# EAGLE schematic MCPGrundplatte8Eingabe_8Ausgabe (EAGLE 9.6.2)
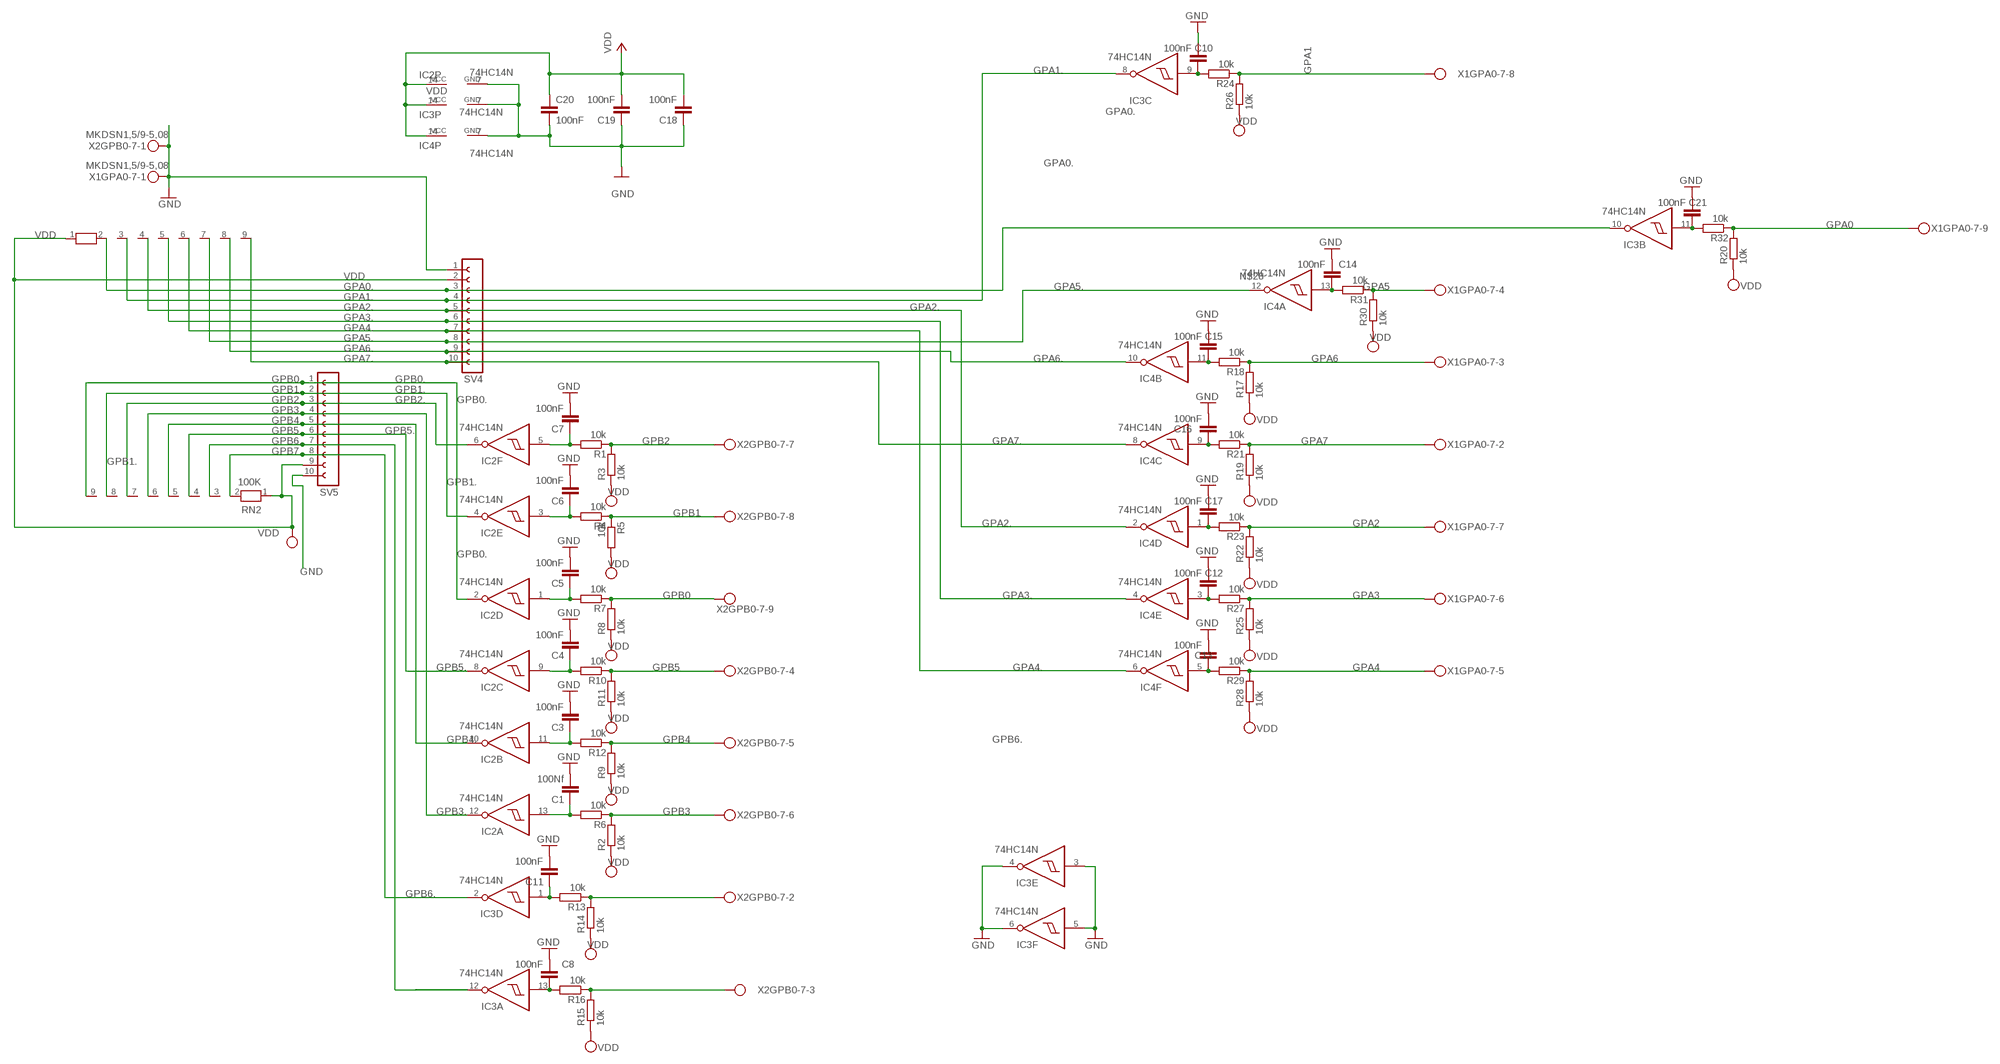
[diagram p0: schematic, sheet 1]

## Parts
C1  100Nf  C-EU025-024X044  [C025-024X044]
C3  100nF  C-EU025-024X044  [C025-024X044]
C4  100nF  C-EU025-024X044  [C025-024X044]
C5  100nF  C-EU025-024X044  [C025-024X044]
C6  100nF  C-EU025-024X044  [C025-024X044]
C7  100nF  C-EU025-024X044  [C025-024X044]
C8  100nF  C-EU025-024X044  [C025-024X044]
C10  100nF  C-EU025-024X044  [C025-024X044]
C11  100nF  C-EU025-024X044  [C025-024X044]
C12  100nF  C-EU025-024X044  [C025-024X044]
C13  100nF  C-EU025-024X044  [C025-024X044]
C14  100nF  C-EU025-024X044  [C025-024X044]
C15  100nF  C-EU025-024X044  [C025-024X044]
C16  100nF  C-EU025-024X044  [C025-024X044]
C17  100nF  C-EU025-024X044  [C025-024X044]
C18  100nF  C-EU025-024X044  [C025-024X044]
C19  100nF  C-EU025-024X044  [C025-024X044]
C20  100nF  C-EU025-024X044  [C025-024X044]
C21  100nF  C-EU025-024X044  [C025-024X044]
IC2  74HC14N  [DIL14]
IC3  74HC14N  [DIL14]
IC4  74HC14N  [DIL14]
R1  10k  R-EU_0207/10  [0207/10]
R2  10k  R-EU_0207/10  [0207/10]
R3  10k  R-EU_0207/10  [0207/10]
R4  10k  R-EU_0207/10  [0207/10]
R5  10k  R-EU_0207/10  [0207/10]
R6  10k  R-EU_0207/10  [0207/10]
R7  10k  R-EU_0207/10  [0207/10]
R8  10k  R-EU_0207/10  [0207/10]
R9  10k  R-EU_0207/10  [0207/10]
R10  10k  R-EU_0207/10  [0207/10]
R11  10k  R-EU_0207/10  [0207/10]
R12  10k  R-EU_0207/10  [0207/10]
R13  10k  R-EU_0207/10  [0207/10]
R14  10k  R-EU_0207/10  [0207/10]
R15  10k  R-EU_0207/10  [0207/10]
R16  10k  R-EU_0207/10  [0207/10]
R17  10k  R-EU_0207/10  [0207/10]
R18  10k  R-EU_0207/10  [0207/10]
R19  10k  R-EU_0207/10  [0207/10]
R20  10k  R-EU_0207/10  [0207/10]
R21  10k  R-EU_0207/10  [0207/10]
R22  10k  R-EU_0207/10  [0207/10]
R23  10k  R-EU_0207/10  [0207/10]
R24  10k  R-EU_0207/10  [0207/10]
R25  10k  R-EU_0207/10  [0207/10]
R26  10k  R-EU_0207/10  [0207/10]
R27  10k  R-EU_0207/10  [0207/10]
R28  10k  R-EU_0207/10  [0207/10]
R29  10k  R-EU_0207/10  [0207/10]
R30  10k  R-EU_0207/10  [0207/10]
R31  10k  R-EU_0207/10  [0207/10]
R32  10k  R-EU_0207/10  [0207/10]
RN1  100K  RN08  [RN-9]
RN2  100K  RN08  [RN-9]
SV4  FE10-1  [FE10]
SV5  FE10-1  [FE10]
X1GPA0-7  MKDSN1,5/9-5,08  [MKDSN1,5/9-5,08]
X2GPB0-7  MKDSN1,5/9-5,08  [MKDSN1,5/9-5,08]

## Nets
GND: C1.2 C3.2 C4.2 C5.2 C6.2 C7.2 C8.2 C10.2 C11.2 C12.2 C13.2 C14.2 C15.2 C16.2 C17.2 C18.1 C19.1 C20.2 C21.2 IC2.7(P:GND) IC3.3(E:I) IC3.4(E:O) IC3.5(F:I) IC3.6(F:O) IC3.7(P:GND) IC4.7(P:GND) SV4.1 SV5.10 X1GPA0-7.1 X2GPB0-7.1
GPA0: R20.2 R32.1 X1GPA0-7.9
GPA0.: IC3.10(B:O) RN1.2 SV4.3
GPA1: R24.1 R26.2 X1GPA0-7.8
GPA1.: IC3.8(C:O) RN1.3 SV4.4
GPA2: R22.2 R23.1 X1GPA0-7.7
GPA2.: IC4.2(D:O) RN1.4 SV4.5
GPA3: R25.2 R27.1 X1GPA0-7.6
GPA3.: IC4.4(E:O) RN1.5 SV4.6
GPA4: R28.2 R29.1 X1GPA0-7.5
GPA4.: IC4.6(F:O) RN1.6 SV4.7
GPA5: R30.2 R31.1 X1GPA0-7.4
GPA5.: IC4.12(A:O) RN1.7 SV4.8
GPA6: R17.2 R18.1 X1GPA0-7.3
GPA6.: IC4.10(B:O) RN1.8 SV4.9
GPA7: R19.2 R21.1 X1GPA0-7.2
GPA7.: IC4.8(C:O) RN1.9 SV4.10
GPB0: R7.1 R8.2 X2GPB0-7.9
GPB0.: IC2.2(D:O) RN2.9 SV5.1
GPB1: R4.1 R5.1 X2GPB0-7.8
GPB1.: IC2.4(E:O) RN2.8 SV5.2
GPB2: R1.1 R3.2 X2GPB0-7.7
GPB2.: IC2.6(F:O) RN2.7 SV5.3
GPB3: R2.2 R6.1 X2GPB0-7.6
GPB3.: IC2.12(A:O) RN2.6 SV5.4
GPB4: R9.2 R12.1 X2GPB0-7.5
GPB4.: IC2.10(B:O) RN2.5 SV5.5
GPB5: R10.1 R11.2 X2GPB0-7.4
GPB5.: IC2.8(C:O) RN2.4 SV5.6
GPB6: R15.2 R16.1 X2GPB0-7.3
GPB6.: IC3.12(A:O) RN2.3 SV5.7
GPB7: R13.1 R14.2 X2GPB0-7.2
GPB7.: IC3.2(D:O) RN2.2 SV5.8
N$2: C7.1 IC2.5(F:I) R1.2
N$4: C1.1 IC2.13(A:I) R6.2
N$5: C6.1 IC2.3(E:I) R4.2
N$6: C5.1 IC2.1(D:I) R7.2
N$7: C4.1 IC2.9(C:I) R10.2
N$8: C3.1 IC2.11(B:I) R12.2
N$9: C8.1 IC3.13(A:I) R16.2
N$10: C10.1 IC3.9(C:I) R24.2
N$11: C11.1 IC3.1(D:I) R13.2
N$12: C12.1 IC4.3(E:I) R27.2
N$13: C13.1 IC4.5(F:I) R29.2
N$16: C15.1 IC4.11(B:I) R18.2
N$20: C16.1 IC4.9(C:I) R21.2
N$21: C17.1 IC4.1(D:I) R23.2
N$28: C14.1 IC4.13(A:I) R31.2
N$52: C21.1 IC3.11(B:I) R32.2
VDD: C18.2 C19.2 C20.1 IC2.14(P:VCC) IC3.14(P:VCC) IC4.14(P:VCC) R2.1 R3.1 R5.2 R8.1 R9.1 R11.1 R14.1 R15.1 R17.1 R19.1 R20.1 R22.1 R25.1 R26.1 R28.1 R30.1 RN1.1 RN2.1 SV4.2 SV5.9

## Library data of the parts
C1 C3-C8 C10-C21 = rcl:C-EU: CAPACITOR, European symbol; SPICEPREFIX: C
IC2-IC4 = 74xx-eu:74*14: Hex schmitt trigger INVERTER
R1-R32 = rcl:R-EU_: RESISTOR, European symbol; SPICEPREFIX: R
RN1 = resistor-net:RN08: RESISTOR NETWORK; OC_FARNELL: unknown; OC_NEWARK: unknown; SPICEPREFIX: X
RN2 = resistor-net:RN08: RESISTOR NETWORK; OC_FARNELL: unknown; OC_NEWARK: unknown
SV4 SV5 = con-lsta:FE10-1: FEMALE HEADER; OC_FARNELL: unknown; OC_NEWARK: unknown
X1GPA0-7 X2GPB0-7 = con-phoenix-508:MKDSN1,5/9-5,08: MKDSN 1,5/ 9-5,08 Printklemme Nennstrom: 13,5 A Nennspannung: 250 V Rastermaß: 5,08 mm Polzahl: 9 Anschlussart: Schraubanschluss Montage: Löten Anschlussrichtung Leiter/Platine: 0 ° Artikelnummer: 1729199 Source: http://eshop.phoenixcontact.com .. 1729199.pdf